# EAGLE design First Schema (EAGLE 7.2.0)
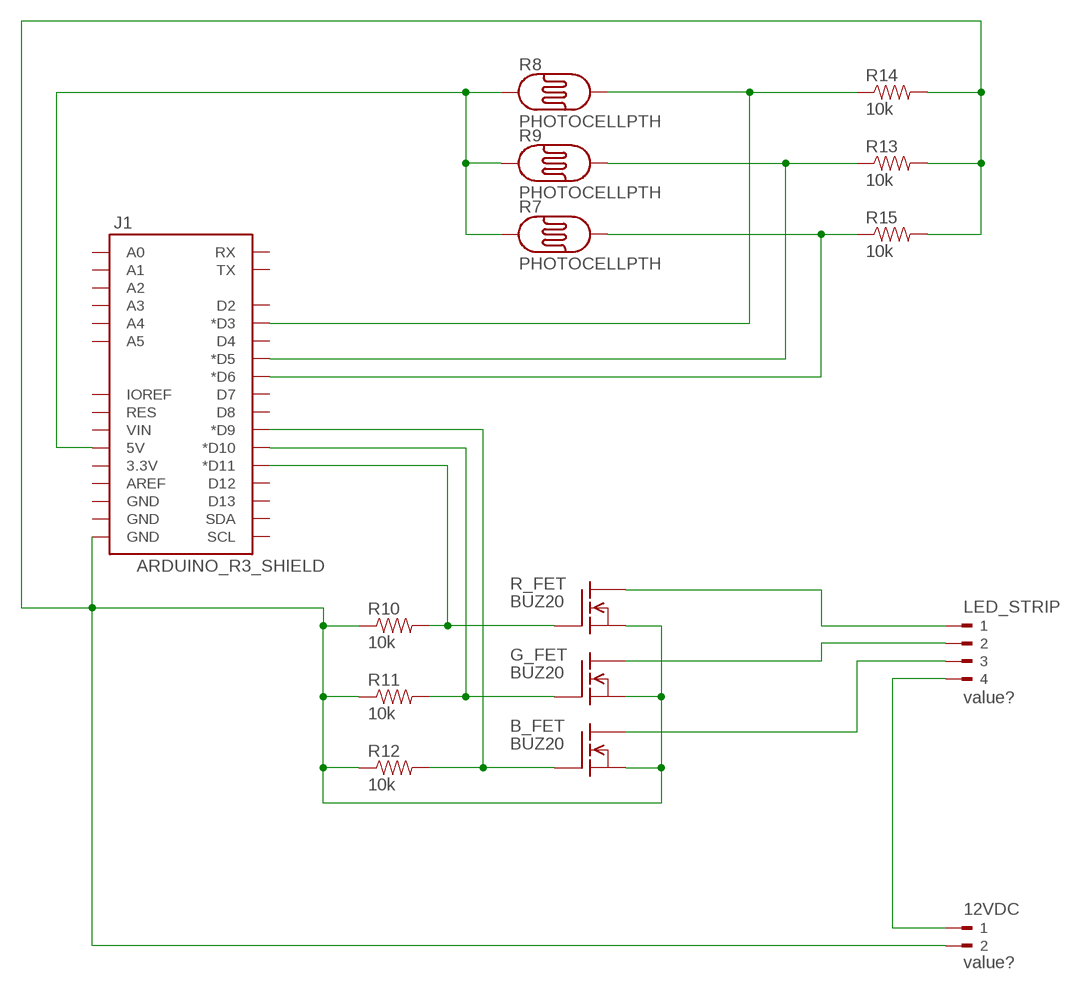
[diagram p0: schematic, sheet 1]

## Parts
12VDC  value?  180-2  [180-2]
B_FET  BUZ20  [TO220]
G_FET  BUZ20  [TO220]
J1  ARDUINO_R3_SHIELD  [UNO_R3_SHIELD]
LED_STRIP  value?  180-4  [180-4]
R7  PHOTOCELLPTH  [PHOTOCELL]
R8  PHOTOCELLPTH  [PHOTOCELL]
R9  PHOTOCELLPTH  [PHOTOCELL]
R10  10k  RESISTORPTH-1/4W  [AXIAL-0.4]
R11  10k  RESISTORPTH-1/4W  [AXIAL-0.4]
R12  10k  RESISTORPTH-1/4W  [AXIAL-0.4]
R13  10k  RESISTORPTH-1/4W  [AXIAL-0.4]
R14  10k  RESISTORPTH-1/4W  [AXIAL-0.4]
R15  10k  RESISTORPTH-1/4W  [AXIAL-0.4]
R_FET  BUZ20  [TO220]

## Nets
N$1: J1.D11(*D11) R10.P$2 R_FET.1(G)
N$2: B_FET.1(G) J1.D9(*D9) R12.P$2
N$4: J1.5V R7.1 R8.1 R9.1
N$5: B_FET.2(D) LED_STRIP.3
N$6: J1.D3(*D3) R8.2 R14.P$1
N$7: LED_STRIP.1 R_FET.2(D)
N$8: G_FET.2(D) LED_STRIP.2
N$9: 12VDC.1 LED_STRIP.4
N$10: 12VDC.2 B_FET.3(S) G_FET.3(S) J1.GND@0(GND) R10.P$1 R11.P$1 R12.P$1 R13.P$2 R14.P$2 R15.P$2 R_FET.3(S)
N$11: J1.D5(*D5) R9.2 R13.P$1
N$12: J1.D6(*D6) R7.2 R15.P$1
N$13: G_FET.1(G) J1.D10(*D10) R11.P$2
Unconnected: J1.3.3V J1.A0 J1.A1 J1.A2 J1.A3 J1.A4 J1.A5 J1.AREF J1.D2 J1.D4 J1.D7 J1.D8 J1.D12 J1.D13 J1.GND@1(GND) J1.GND@2(GND) J1.IOREF J1.RES J1.RX J1.SCL J1.SDA J1.TX J1.VIN

## Library data of the parts
12VDC = con-weidmueller-sl35:180-2: WEIDMUELLER CLAMP CONNECTOR; OC_FARNELL: unknown; OC_NEWARK: unknown
B_FET G_FET R_FET = transistor-fet:BUZ20: N-Channel Enhancement MOSFET 100V; 12A; 0,2Ohm
J1 = SparkFun-Boards:ARDUINO_R3_SHIELD: Shield form compatible with the Arduino Uno R3.
LED_STRIP = con-weidmueller-sl35:180-4: WEIDMUELLER CLAMP CONNECTOR; OC_FARNELL: unknown; OC_NEWARK: unknown
R7-R9 = SparkFun-Sensors:PHOTOCELL: CdS photoresistor. This is a low cost way to detect light levels. Resistance decreases with more incoming light. SparkFun SKU: SEN-09088
R10-R15 = SparkFun-Passives:RESISTOR: Resistor Basic schematic elements and footprints for 0603, 1206, and PTH resistors.

## Board
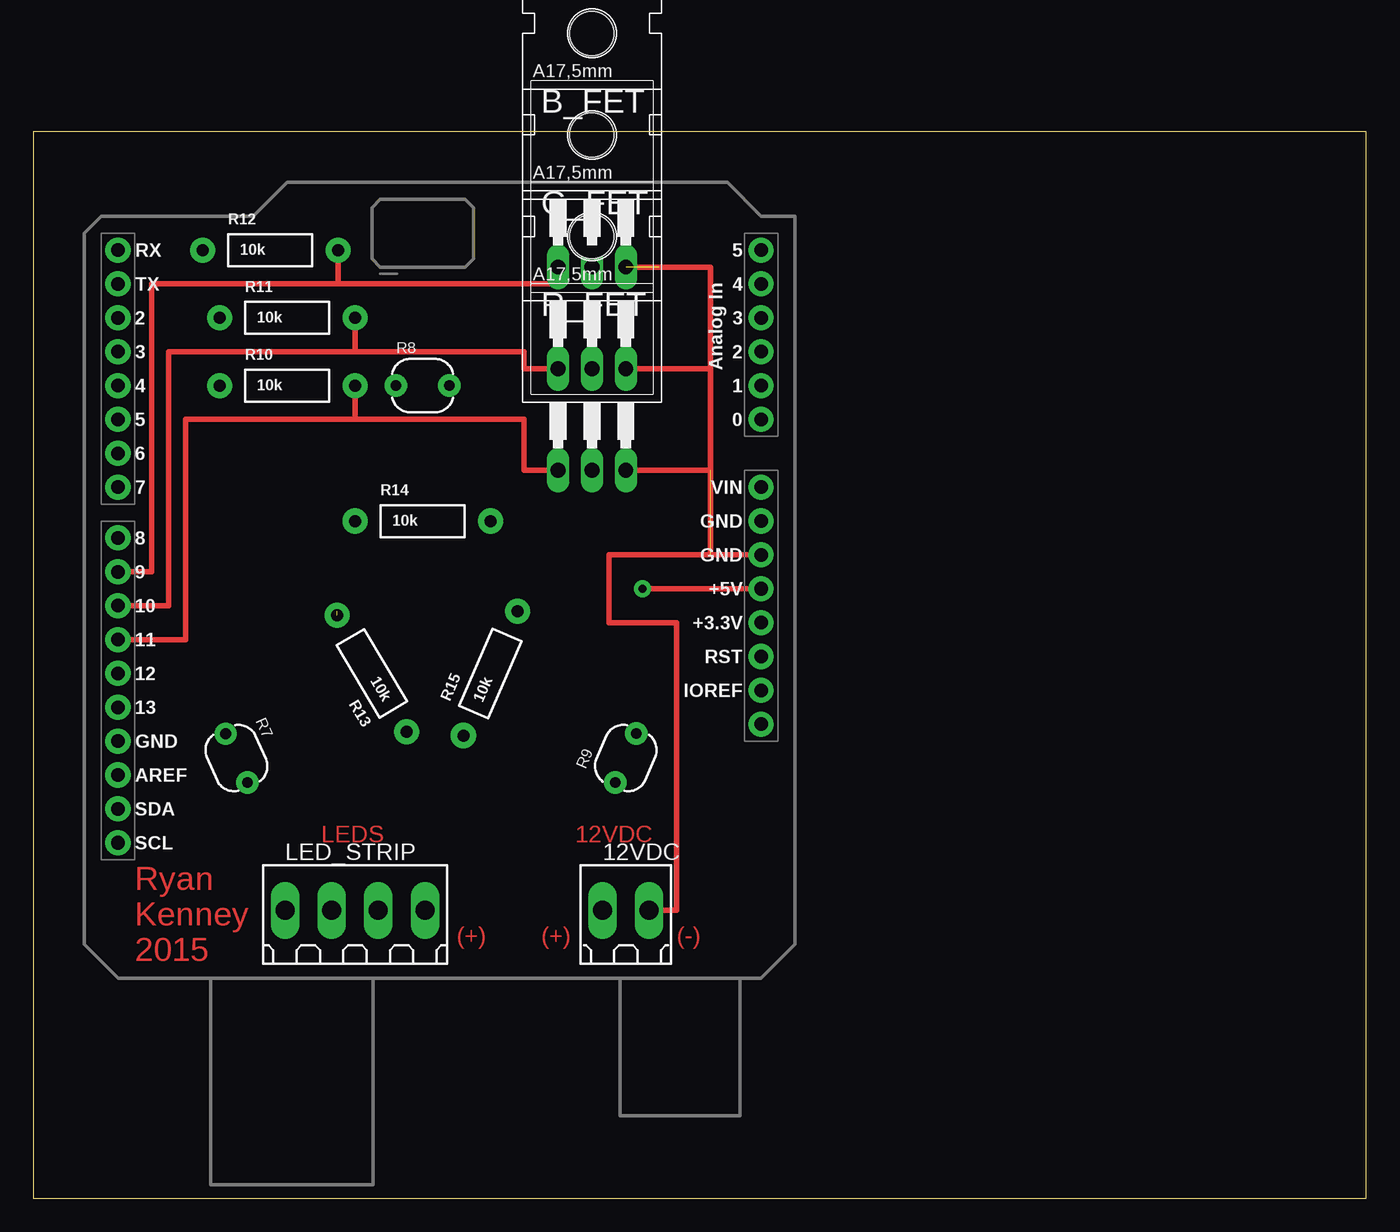
[diagram p1: board, top side]
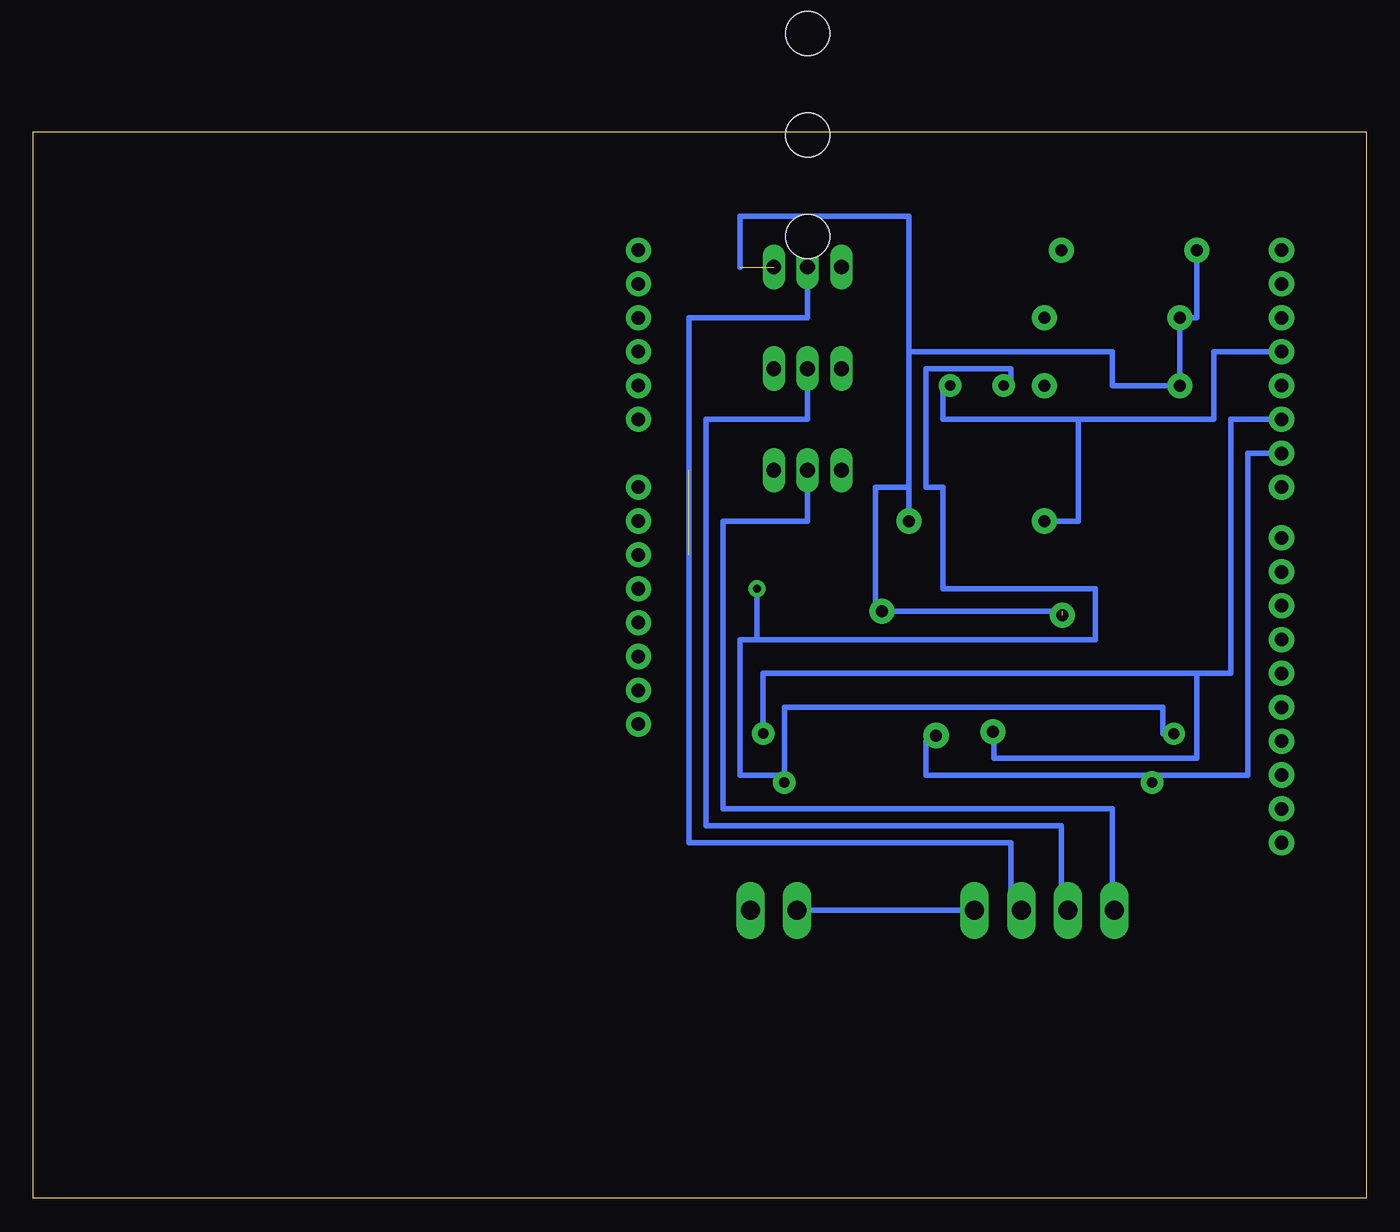
[diagram p2: board, bottom side, seen from below]

Size 100 x 80 mm. Coordinates in mm from the lower left corner, seen from the top.
Outline: 0,0 100,0 100,80 0,80 0,0
Copper layers (1*16): Top 0.035mm / dielectric 1.5mm / Bottom 0.035mm
Design rules "default": minimum track width 10mil, minimum drill 24mil, track to track 8mil, track to pad 8mil, pad to pad 8mil, via to via 8mil, smd to smd 8mil, copper to edge 40mil, drill to drill 8mil, minimum pad ring 10mil, minimum via ring 8mil, stop-mask expansion 4mil, vias tented up to drill 0mil, thermal gap 10mil

### Footprints (pad centres in the part's own frame; a part is rotated, then mirrored left to right if it is on the bottom)
180-2 = drill 1.422 long: 1 -1.75,0; 2 1.75,0
TO220 = drill 1.118 long: 1 -2.54,-6.35; 2 0,-6.35; 3 2.54,-6.35 | hole 3.302: 0,11.176
UNO_R3_SHIELD = drill 1.016 pad 1.88: 3.3V 50.8,26.67; 5V 50.8,29.21; A0 50.8,41.91; A1 50.8,44.45; A2 50.8,46.99; A3 50.8,49.53; A4 50.8,52.07; A5 50.8,54.61; AREF 2.54,15.24; D2 2.54,49.53; D3 2.54,46.99; D4 2.54,44.45; D5 2.54,41.91; D6 2.54,39.37; D7 2.54,36.83; D8 2.54,33.02; D9 2.54,30.48; D10 2.54,27.94; D11 2.54,25.4; D12 2.54,22.86; D13 2.54,20.32; GND@0 50.8,31.75; GND@1 50.8,34.29; GND@2 2.54,17.78; IOREF 50.8,21.59; NC 50.8,19.05; RES 50.8,24.13; RX 2.54,54.61; SCL 2.54,10.16; SDA 2.54,12.7; TX 2.54,52.07; VIN 50.8,36.83
180-4 = drill 1.422 long: 1 -5.25,0; 2 -1.75,0; 3 1.75,0; 4 5.25,0
PHOTOCELL = drill 0.8 pad 1.676: 1 -2,0; 2 2,0
AXIAL-0.4 = drill 0.9 pad 1.88: P$1 -5.08,0; P$2 5.08,0

### Placement (x,y rotation side)
12VDC  44.45,21.59 0 top
B_FET  41.91,76.2 0 top
G_FET  41.91,68.58 0 top
J1  3.81,16.51 0 top
LED_STRIP  24.13,21.59 0 top
R7  15.24,33.02 294 top
R8  29.21,60.96 0 top
R9  44.45,33.02 66.8 top
R10  19.05,60.96 0 top
R11  19.05,66.04 0 top
R12  17.78,71.12 0 top
R13  25.4,39.37 120.7 top
R14  29.21,50.8 0 top
R15  34.29,39.37 66.5 top
R_FET  41.91,60.96 0 top

### Tracks (layer width: path | path; a pad name or v marks a point on that pad's centre or on a via)
N$1
  Top 0.406: J1.D11 11.43,41.91 11.43,58.42 24.13,58.42 | R10.P$2 24.13,58.42 | 24.13,58.42 36.83,58.42 36.83,54.61 R_FET.1
N$2
  Top 0.406: J1.D9 8.89,46.99 8.89,68.58 22.86,68.58 | R12.P$2 22.86,68.58 | 22.86,68.58 39.37,68.58 B_FET.1
N$3  (via drill 0.6 pad 1.27)
  other vias: 45.72,45.72
N$4  (via drill 0.6 pad 1.27)
  Top 0.406: J1.5V v45.72,45.72
  Bottom 0.406: R7.1 15.24,34.85 15.24,36.83 43.66,36.83 43.66,31.75 | 43.66,31.75 R9.1 | R8.1 26.67,60.96 26.67,62.23 33.02,62.23 33.02,53.34 31.75,53.34 31.75,45.72 20.32,45.72 20.32,41.91 45.72,41.91 | 45.72,41.91 46.99,41.91 46.99,31.75 43.66,31.75 | v45.72,45.72 45.72,41.91
N$5
  Bottom 0.406: B_FET.2 41.91,66.04 50.8,66.04 50.8,26.67 26.67,26.67 26.67,21.59 LED_STRIP.3
N$6
  Bottom 0.406: J1.D3 11.43,63.5 11.43,58.42 21.59,58.42 | 21.59,58.42 31.75,58.42 31.75,60.96 R8.2 | R14.P$1 21.59,50.8 21.59,58.42
N$7
  Bottom 0.406: R_FET.2 41.91,50.8 48.26,50.8 48.26,29.21 19.05,29.21 19.05,21.59 LED_STRIP.1
N$8
  Bottom 0.406: G_FET.2 41.91,58.42 49.53,58.42 49.53,27.94 22.86,27.94 22.86,21.59 LED_STRIP.2
N$9
  Bottom 0.406: LED_STRIP.4 12VDC.1
N$10  (3 unrouted)
  Top 0.406: J1.GND@0 50.8,48.26 | 50.8,48.26 50.8,54.61 | 50.8,54.61 50.8,62.23 | 50.8,62.23 50.8,69.85 B_FET.3 | G_FET.3 50.8,62.23 | 12VDC.2 48.26,21.59 48.26,43.18 43.18,43.18 43.18,48.26 50.8,48.26 | R_FET.3 50.8,54.61
  Bottom 0.406: R12.P$1 12.7,66.04 R11.P$1 R10.P$1 19.05,60.96 19.05,63.5 34.29,63.5 | 22.81,44.03 R15.P$2 36.32,44.45 36.83,44.45 36.83,53.34 34.29,53.34 | R14.P$2 34.29,53.34 | 34.29,53.34 34.29,63.5 | 34.29,63.5 34.29,73.66 46.99,73.66 46.99,69.85
N$11
  Bottom 0.406: J1.D5 10.16,58.42 10.16,39.37 12.7,39.37 | R9.2 45.24,39.37 12.7,39.37 | R13.P$1 27.94,35 27.94,33.02 12.7,33.02 12.7,39.37
N$12
  Bottom 0.406: J1.D6 8.89,55.88 8.89,31.75 16.05,31.75 | 16.05,31.75 R7.2 | 16.05,31.75 33.02,31.75 33.02,34.29 32.26,34.29 R15.P$1
N$13
  Top 0.406: J1.D10 10.16,44.45 10.16,63.5 24.13,63.5 | R11.P$2 24.13,63.5 | 24.13,63.5 36.83,63.5 36.83,62.23 G_FET.1

### Text on the board
Top: LEDS | 12VDC | (+) | (+) | (-) | Ryan / Kenney / 2015